# EAGLE design untitled (EAGLE 9.6.2)
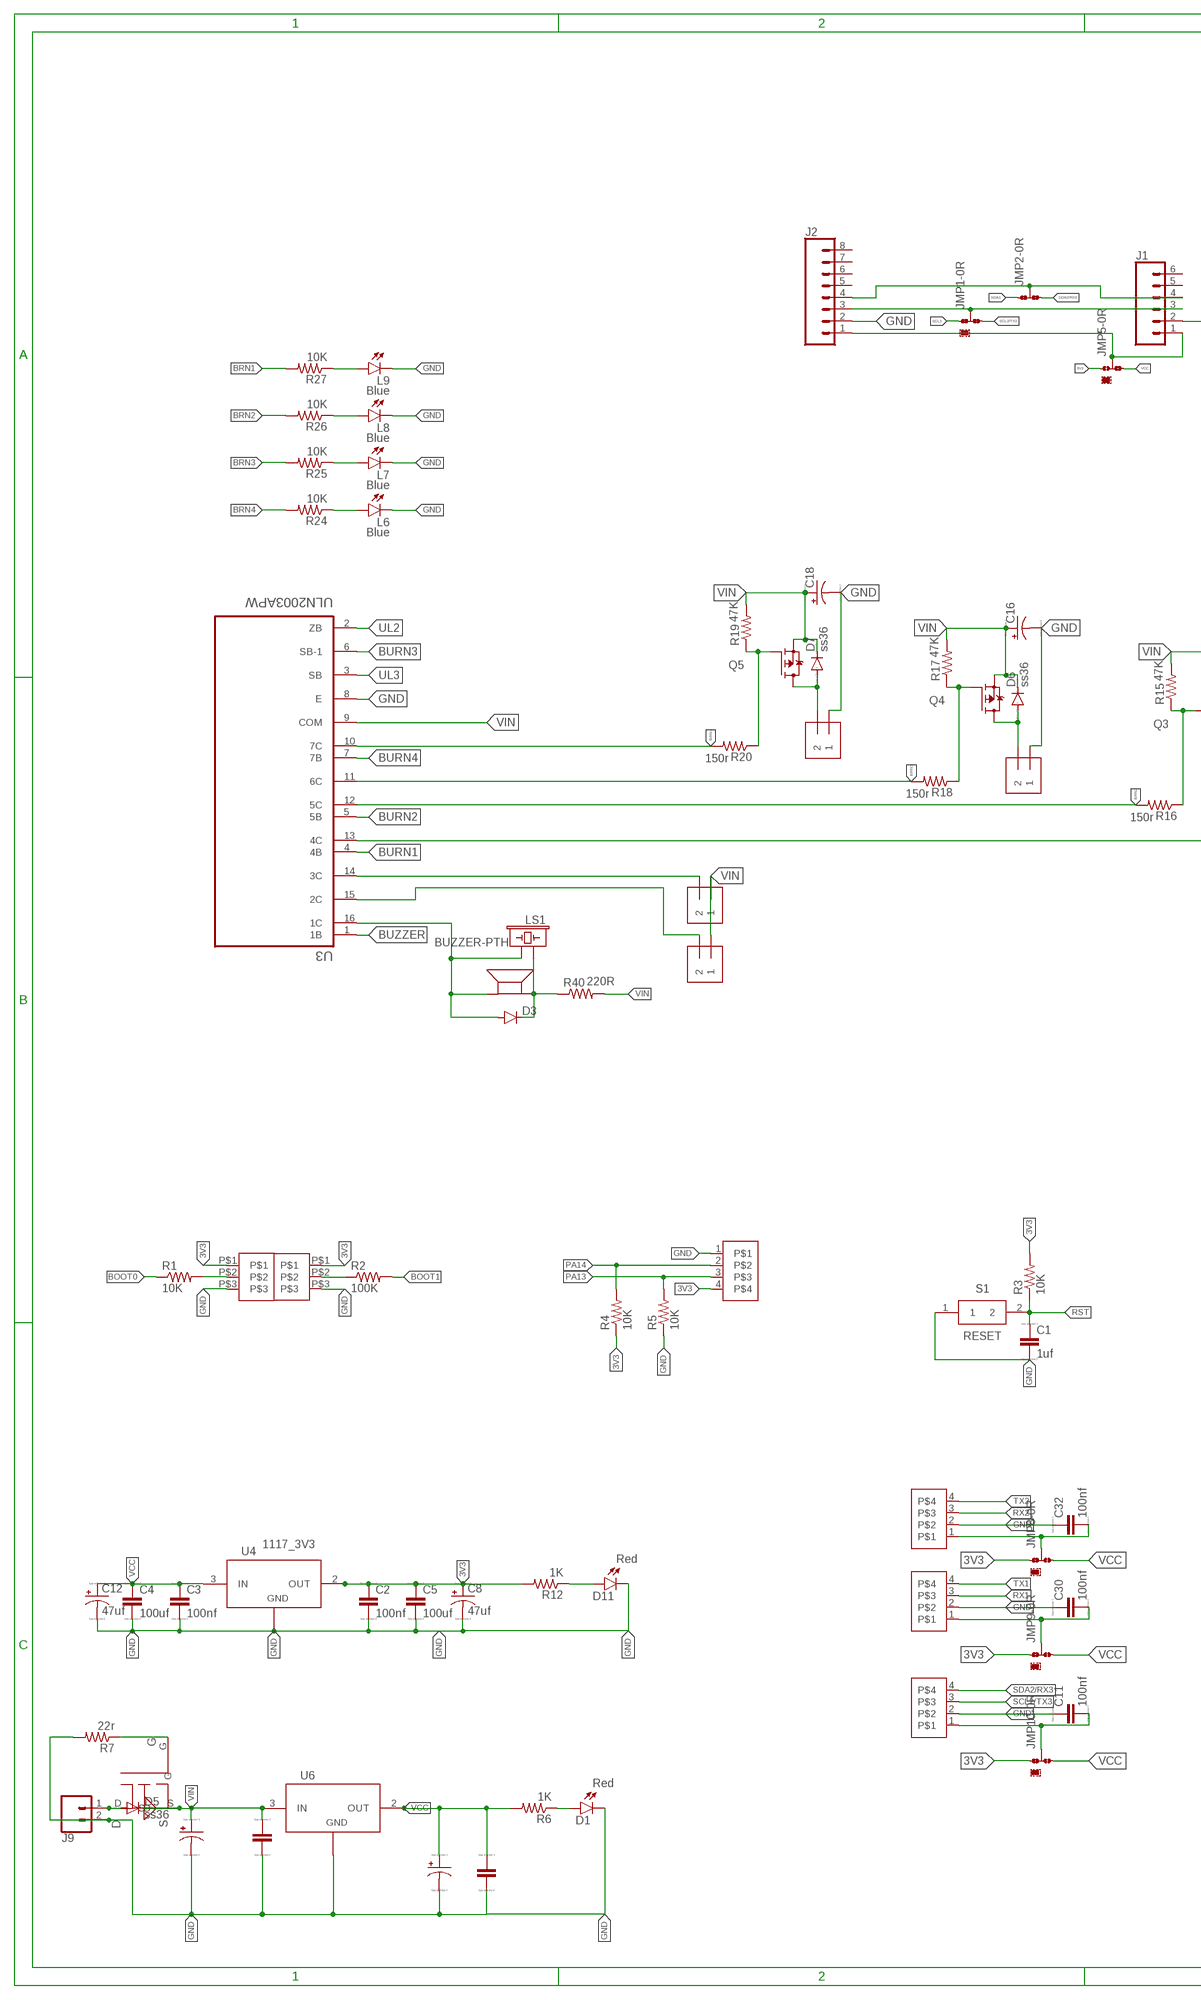
[diagram p0: schematic, sheet 1, part 1 of 2]
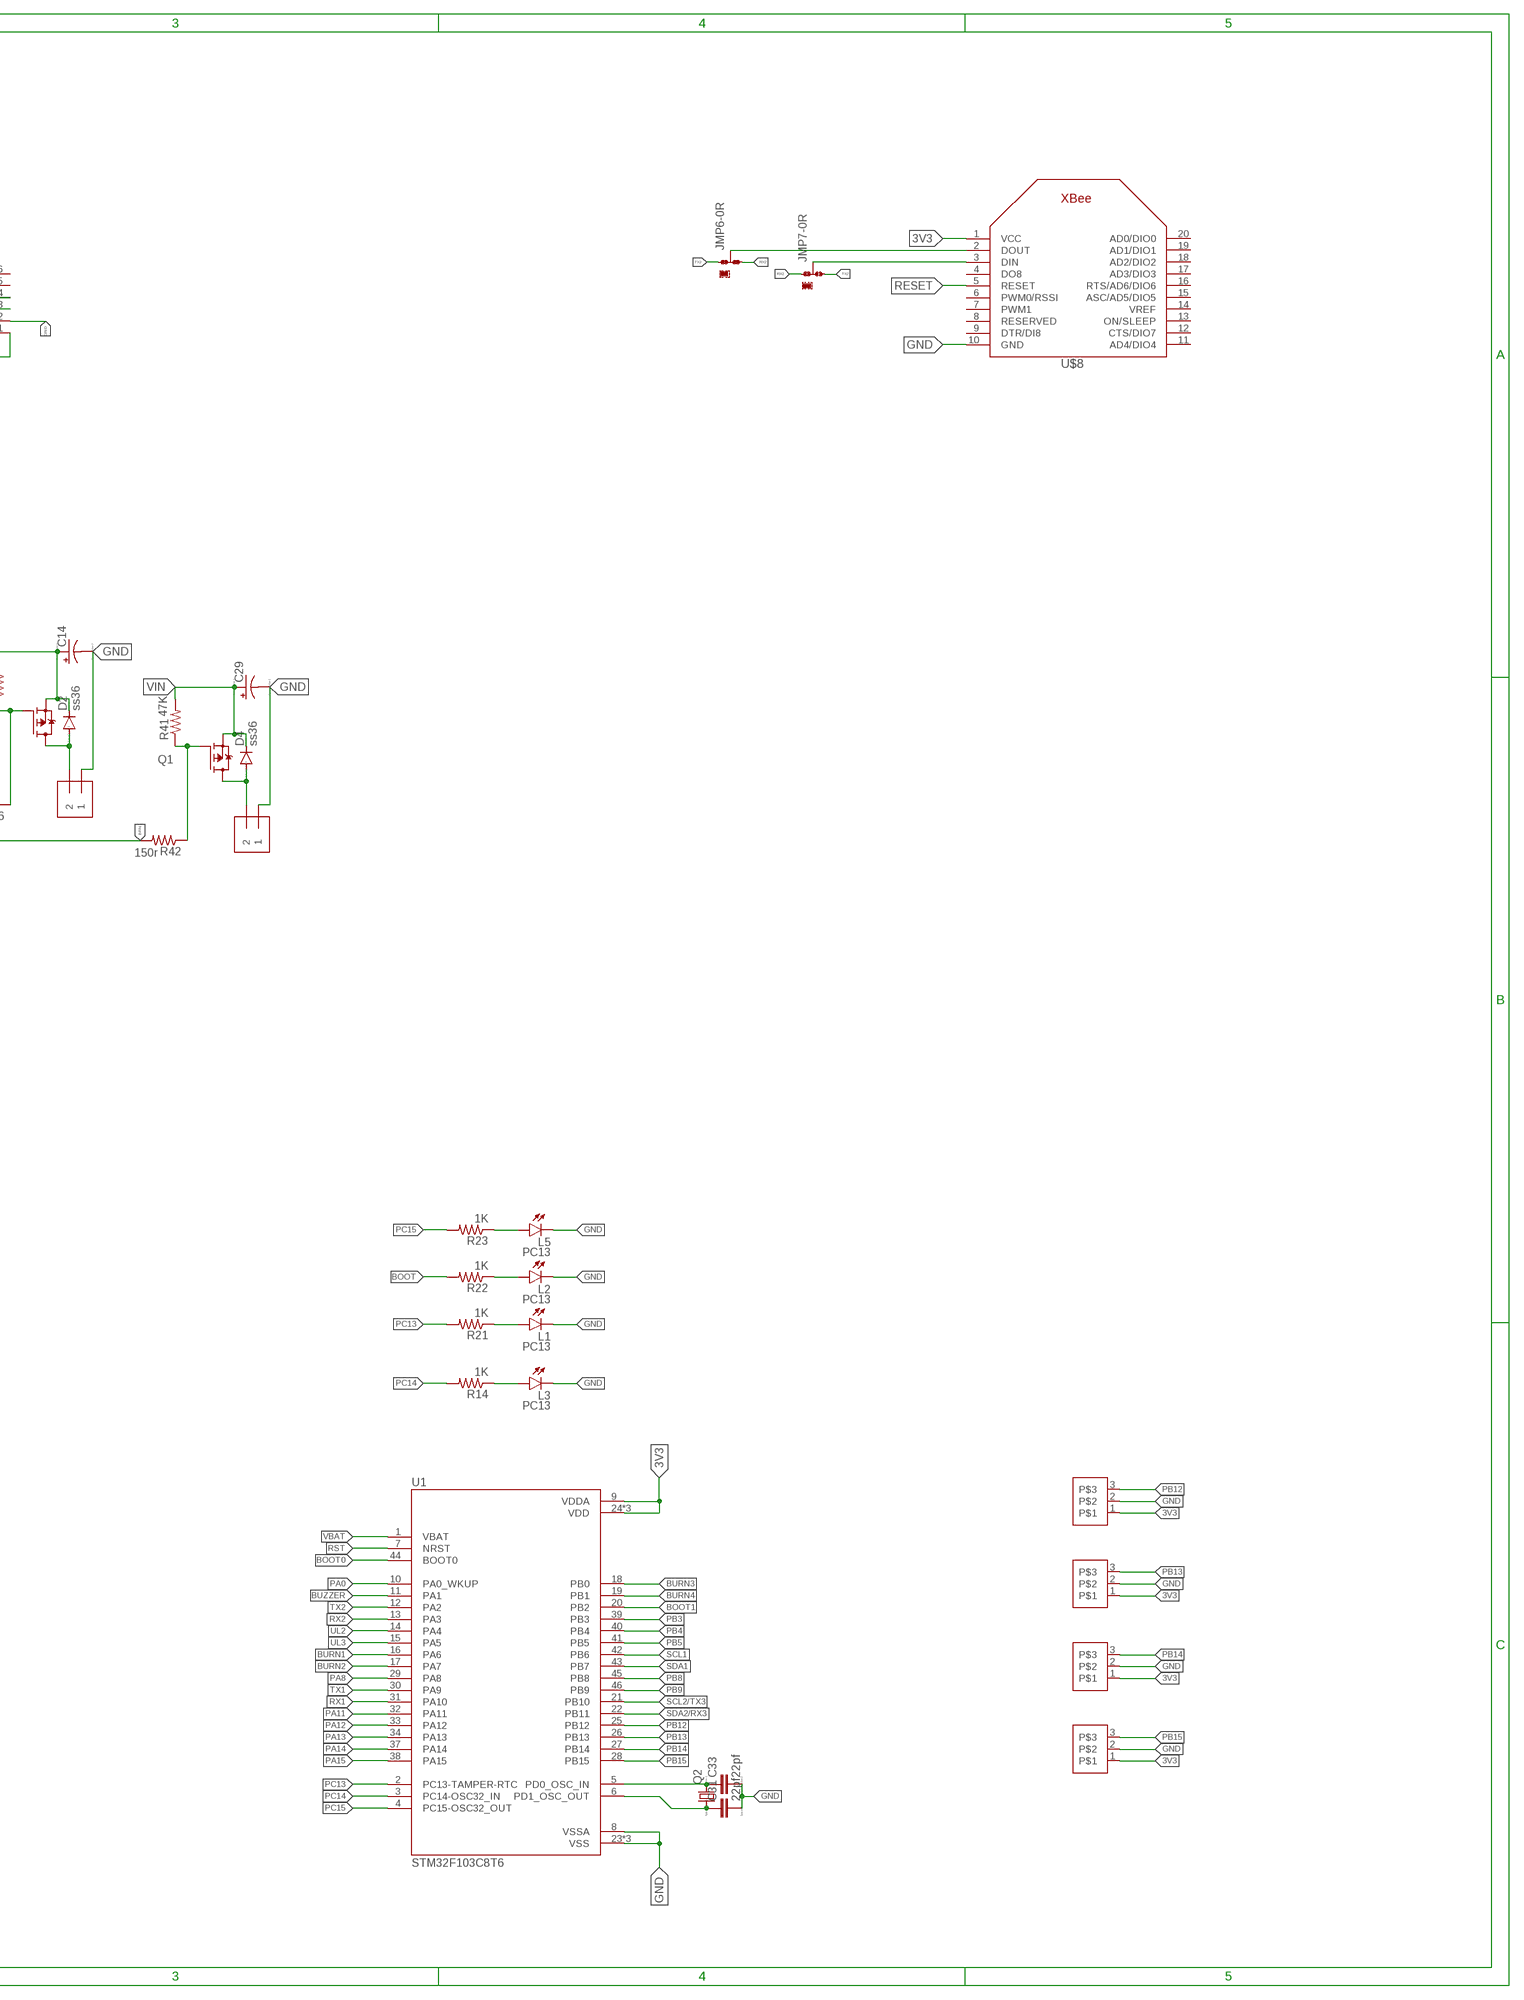
[diagram p1: schematic, sheet 1, part 2 of 2]

## Parts
C1  1uf  CAPACITOR_CER4  [C0603]
C2  100nf  CAPACITOR_CER4  [C0603]
C3  100nf  CAPACITOR_CER4  [C0603]
C4  100uf  CAPACITOR_CER9  [C1210]
C5  100uf  CAPACITOR_CER9  [C1210]
C6  100nf  CAPACITOR_CER4  [C0603]
C7  100uf  CAPACITOR_POLD  [PANASONIC_D]
C8  47uf  CAPACITOR_POLC  [PANASONIC_C]
C9  100nf  CAPACITOR_CER4  [C0603]
C10  100uf  CAPACITOR_POLD  [PANASONIC_D]
C11  100nf  CAPACITOR_CER4  [C0603]
C12  47uf  CAPACITOR_POLC  [PANASONIC_C]
C14  CAPACITOR_POLC  [PANASONIC_C]
C16  CAPACITOR_POLC  [PANASONIC_C]
C18  CAPACITOR_POLC  [PANASONIC_C]
C29  CAPACITOR_POLC  [PANASONIC_C]
C30  100nf  CAPACITOR_CER4  [C0603]
C31  22pf  CAPACITOR_CER4  [C0603]
C32  100nf  CAPACITOR_CER4  [C0603]
C33  22pf  CAPACITOR_CER4  [C0603]
D1  Red  LED0603_R  [0603_LED_GREEN]
D2  ss36  DIODEAC2  [DO-214AC]
D3  DIODESOD  [SOD-323]
D4  ss36  DIODEAC2  [DO-214AC]
D5  ss36  DIODEAC2  [DO-214AC]
D6  ss36  DIODEAC2  [DO-214AC]
D7  ss36  DIODEAC2  [DO-214AC]
D11  Red  LED0603_R  [0603_LED_GREEN]
J1  CONN_06NO_SILK_NO_POP  [1X06_NO_SILK]
J2  CONN_08NO_SILK_FEMALE_PTH  [1X08_NO_SILK]
J9  CONN_025MM  [SCREWTERMINAL-5MM-2]
JMP1  0R-JUMPA  [A0R-JMP]
JMP2  0R-JUMPA  [A0R-JMP]
JMP5  0R-JUMPA  [A0R-JMP]
JMP6  0R-JUMPA  [A0R-JMP]
JMP7  0R-JUMPA  [A0R-JMP]
JMP8  0R-JUMPA  [A0R-JMP]
JMP9  0R-JUMPA  [A0R-JMP]
JMP10  0R-JUMPA  [A0R-JMP]
L1  PC13  LED0603_R  [0603_LED_GREEN]
L2  PC13  LED0603_R  [0603_LED_GREEN]
L3  PC13  LED0603_R  [0603_LED_GREEN]
L5  PC13  LED0603_R  [0603_LED_GREEN]
L6  Blue  LED0603_R  [0603_LED_GREEN]
L7  Blue  LED0603_R  [0603_LED_GREEN]
L8  Blue  LED0603_R  [0603_LED_GREEN]
L9  Blue  LED0603_R  [0603_LED_GREEN]
LS1  BUZZER-PTH  [BUZZER-12MM]
Q1  FDD4141TO252  [TO252]
Q2  CRYSTALHC49U-V  [HC49U-V]
Q3  FDD4141TO252  [TO252]
Q4  FDD4141TO252  [TO252]
Q5  FDD4141TO252  [TO252]
Q6  AON7401  [DFN-8_3X3]
R1  10K  RESISTOR0603  [R0603]
R2  100K  RESISTOR0603  [R0603]
R3  10K  RESISTOR0603  [R0603]
R4  10K  RESISTOR0603  [R0603]
R5  10K  RESISTOR0603  [R0603]
R6  1K  RESISTOR0603  [R0603]
R7  22r  RESISTOR0603  [R0603]
R12  1K  RESISTOR0603  [R0603]
R14  1K  RESISTOR0603  [R0603]
R15  47K  RESISTOR0603  [R0603]
R16  150r  RESISTOR0603  [R0603]
R17  47K  RESISTOR0603  [R0603]
R18  150r  RESISTOR0603  [R0603]
R19  47K  RESISTOR0603  [R0603]
R20  150r  RESISTOR0603  [R0603]
R21  1K  RESISTOR0603  [R0603]
R22  1K  RESISTOR0603  [R0603]
R23  1K  RESISTOR0603  [R0603]
R24  10K  RESISTOR0603  [R0603]
R25  10K  RESISTOR0603  [R0603]
R26  10K  RESISTOR0603  [R0603]
R27  10K  RESISTOR0603  [R0603]
R40  220R  RESISTOR0603  [R0603]
R41  47K  RESISTOR0603  [R0603]
R42  150r  RESISTOR0603  [R0603]
S1  RESET  SKRKAEE010  [SKRK]
U1  STM32F103C8T6  [QFP50P900X900X160-48N]
U3  ULN2003APW  [SOP65P640X120-16N]
U4  1117_3V3  NCP1117ST33T3G  [SOT-223]
U6  1117_3V3  NCP1117ST33T3G  [SOT-223]
U$1  FML_1X32MM  [1X3_2MM]
U$2  FML_1X32MM  [1X3_2MM]
U$3  FML_1X4  [HDRVR4W64P254_1X4_1016X240X800B]
U$4  1X2  [1X2]
U$5  1X2  [1X2]
U$6  1X2  [1X2]
U$7  FML_1X4  [HDRVR4W64P254_1X4_1016X240X800B]
U$8  XBEE  [XBEE]
U$9  Z_STOP  FML_1X3  [HDRVR3W64P254_1X3_762X240X800B]
U$11  FML_1X4  [HDRVR4W64P254_1X4_1016X240X800B]
U$12  FML_1X4  [HDRVR4W64P254_1X4_1016X240X800B]
U$13  Z_STOP  FML_1X3  [HDRVR3W64P254_1X3_762X240X800B]
U$14  Y_STOP  FML_1X3  [HDRVR3W64P254_1X3_762X240X800B]
U$15  X_STOP  FML_1X3  [HDRVR3W64P254_1X3_762X240X800B]
U$19  7.5X7.5_BUZZER  [SMD_7.5_BUZZER]
U$20  1X2  [1X2]
U$21  1X2  [1X2]
U$22  1X2  [1X2]

## Nets
3V3: C2.1 C5.1 C8.+ JMP5.1 JMP8.1 JMP9.1 JMP10.1 R3.2 R4.1 R12.2 U1.9(VDDA) U1.24(VDD) U1.36(VDD) U1.48(VDD) U4.2(OUT) U4.4 U$1.P$1 U$2.P$1 U$3.4 U$8.1(VCC) U$9.1 U$13.1 U$14.1 U$15.1
BOOT: R1.2 R22.2 U$2.P$2
BOOT0: R1.1 U1.44(BOOT0)
BOOT1: R2.2 U1.20(PB2)
BRN1: R27.2 R42.2 U3.13(4C)
BRN2: R16.2 R26.2 U3.12(5C)
BRN3: R18.2 R25.2 U3.11(6C)
BRN4: R20.2 R24.2 U3.10(7C)
BURN1: U1.16(PA6) U3.4(4B)
BURN2: U1.17(PA7) U3.5(5B)
BURN3: U1.18(PB0) U3.6(SB-1)
BURN4: U1.19(PB1) U3.7(7B)
BUZZER: U1.11(PA1) U3.1(1B)
GND: C1.2 C2.2 C3.2 C4.2 C5.2 C6.2 C7.- C8.- C9.2 C10.- C11.1 C12.- C14.- C16.- C18.- C29.- C30.1 C31.2 C32.1 C33.2 D1.C D11.C J1.2 J2.2 J9.2 L1.C L2.C L3.C L5.C L6.C L7.C L8.C L9.C R5.1 R7.2 S1.1 U1.8(VSSA) U1.23(VSS) U1.35(VSS) U1.47(VSS) U3.8(E) U4.1(ADJ/GND) U6.1(ADJ/GND) U$1.P$3 U$2.P$3 U$3.1 U$4.P$1 U$5.P$1 U$6.P$1 U$7.2 U$8.10(GND) U$9.2 U$11.2 U$12.2 U$13.2 U$14.2 U$15.2 U$21.P$1
N$2: Q6.G R7.1
N$5: R2.1 U$1.P$2
N$7: D1.A R6.1
N$8: D11.A R12.1
N$9: JMP6.2 U$8.2(DOUT)
N$10: JMP7.2 U$8.3(DIN)
N$11: C30.2 JMP9.2 U$12.1
N$12: L3.A R14.1
N$13: D2.A Q3.3(D) U$4.P$2
N$14: Q3.1(G) R15.1 R16.1
N$15: D6.A Q4.3(D) U$5.P$2
N$16: Q4.1(G) R17.1 R18.1
N$17: D7.A Q5.3(D) U$6.P$2
N$18: Q5.1(G) R19.1 R20.1
N$19: C33.1 Q2.2 U1.5(PD0_OSC_IN)
N$20: C31.1 Q2.1 U1.6(PD1_OSC_OUT)
N$21: L1.A R21.1
N$22: L2.A R22.1
N$23: L5.A R23.1
N$24: L6.A R24.1
N$25: L7.A R25.1
N$26: L8.A R26.1
N$27: L9.A R27.1
N$28: C11.2 JMP10.2 U$7.1
N$29: J1.1 J2.1 JMP5.2
N$30: J1.3 J2.3 JMP1.2
N$31: J1.4 J2.4 JMP2.2
N$49: C32.2 JMP8.2 U$11.1
N$59: D5.A J9.1 Q6.D
N$71: U3.15(2C) U$20.P$2
N$72: U3.14(3C) U$22.P$2
N$76: D3.A LS1.- U3.16(1C) U$19.-
N$77: D3.C LS1.+ R40.1 U$19.+
N$78: D4.A Q1.3(D) U$21.P$2
N$79: Q1.1(G) R41.1 R42.1
PA0: U1.10(PA0_WKUP)
PA8: U1.29(PA8)
PA11: U1.32(PA11)
PA12: U1.33(PA12)
PA13: R5.2 U1.34(PA13) U$3.3
PA14: R4.2 U1.37(PA14) U$3.2
PA15: U1.38(PA15)
PB3: U1.39(PB3)
PB4: U1.40(PB4)
PB5: U1.41(PB5)
PB8: U1.45(PB8)
PB9: U1.46(PB9)
PB12: U1.25(PB12) U$9.3
PB13: U1.26(PB13) U$13.3
PB14: U1.27(PB14) U$14.3
PB15: U1.28(PB15) U$15.3
PC13: R21.2 U1.2(PC13-TAMPER-RTC)
PC14: R14.2 U1.3(PC14-OSC32_IN)
PC15: R23.2 U1.4(PC15-OSC32_OUT)
RESET: U$8.5(RESET)
RST: C1.1 R3.1 S1.2 U1.7(NRST)
RX1: U1.31(PA10) U$12.3
RX2: JMP6.3 JMP7.1 U1.13(PA3) U$11.3
SCL1: JMP1.1 U1.42(PB6)
SCL2/TX3: JMP1.3 U1.21(PB10) U$7.3
SDA1: JMP2.1 U1.43(PB7)
SDA2/RX3: JMP2.3 U1.22(PB11) U$7.4
TX1: U1.30(PA9) U$12.4
TX2: JMP6.1 JMP7.3 U1.12(PA2) U$11.4
UL2: U1.14(PA4) U3.2(ZB)
UL3: U1.15(PA5) U3.3(SB)
VBAT: U1.1(VBAT)
VCC: C3.1 C4.1 C6.1 C7.+ C12.+ JMP5.3 JMP8.3 JMP9.3 JMP10.3 R6.2 U4.3(IN) U6.2(OUT) U6.4
VIN: C9.1 C10.+ C14.+ C16.+ C18.+ C29.+ D2.C D4.C D5.C D6.C D7.C Q1.2(S) Q3.2(S) Q4.2(S) Q5.2(S) Q6.S R15.2 R17.2 R19.2 R40.2 R41.2 U3.9(COM) U6.3(IN) U$20.P$1 U$22.P$1
Unconnected: J1.5 J1.6 J2.5 J2.6 J2.7 J2.8 U$8.4(DO8) U$8.6(PWM0/RSSI) U$8.7(PWM1) U$8.8(RESERVED) U$8.9(DTR/DI8) U$8.11(AD4/DIO4) U$8.12(CTS/DIO7) U$8.13(ON/SLEEP) U$8.14(VREF) U$8.15(ASC/AD5/DIO5) U$8.16(RTS/AD6/DIO6) U$8.17(AD3/DIO3) U$8.18(AD2/DIO2) U$8.19(AD1/DIO1) U$8.20(AD0/DIO0)

## Library data of the parts
C1-C6 C9 C11 C30-C33 = pasif_com1:CAPACITOR_CER
C7 C8 C10 C12 C14 C16 C18 C29 = pasif_com1:CAPACITOR_POL
D1 D11 L1-L3 L5-L9 = pasif_com1:LED
D2 D4-D7 = pasif_com1:DIODE
D3 = BeagleBone_Blue_R3:DIODE: Diode These are standard reverse protection diodes and small signal diodes. SMA package can handle up to about 1A. SOD-323 can handle about 200mA. What the SOD-323 package when ordering, there are some mfgs out there that are 5-pin packages.; PROD_ID: DIO-09646
J1 = SparkFun-Connectors:CONN_06: Multi connection point. Often used as Generic Header-pin footprint for 0.1 inch spaced/style header connections On any of the 0.1 inch spaced packages, you can populate with these: Break Away Headers - Straight <https://www.sparkfun.com/products/116> (PRT-00116) Break Away Male Headers - Right Angle <https://www.sparkfun.com/products/553> (PRT-00553) Female Headers <https://www.sparkfun.com/products/115> (PRT-00115) Break Away Headers - Machine Pin <https://www.sparkfun.com/products/117> (PRT-00117) Break Away Female Headers - Swiss Machine Pin <https://www.sparkfun.com/products/743> (PRT-00743) Arduino Stackable Header - 6 Pin <https://www.sparkfun.com/products/9280> (PRT-09280) For SCREWTERMINALS and SPRING TERMINALS visit here: Screw Terimnals on SparkFun.com <https://www.sparkfun.com/search/results?term=Screw+Terminals> (5mm/3.5mm/2.54mm spacing) This device is also useful as a general connection point to wire up your design to another part of your project. Our various solder wires solder well into these plated through hole pads. Hook-Up Wire - Assortment (Stranded, 22 AWG) <https://www.sparkfun.com/products/11375> (PRT-11375) Hook-Up Wire - Assortment (Solid Core, 22 AWG) <https://www.sparkfun.com/products/11367> (PRT-11367) View the entire wire category on our website here <https://www.sparkfun.com/categories/141>
J2 = SparkFun-Connectors:CONN_08: Multi connection point. Often used as Generic Header-pin footprint for 0.1 inch spaced/style header connections On any of the 0.1 inch spaced packages, you can populate with these: Break Away Headers - Straight <https://www.sparkfun.com/products/116> (PRT-00116) Break Away Male Headers - Right Angle <https://www.sparkfun.com/products/553> (PRT-00553) Female Headers <https://www.sparkfun.com/products/115> (PRT-00115) Break Away Headers - Machine Pin <https://www.sparkfun.com/products/117> (PRT-00117) Break Away Female Headers - Swiss Machine Pin <https://www.sparkfun.com/products/743> (PRT-00743) Arduino Stackable Header - 8 Pin <https://www.sparkfun.com/products/9279> (PRT-09279) For SCREWTERMINALS and SPRING TERMINALS visit here: Screw Terimnals on SparkFun.com <https://www.sparkfun.com/search/results?term=Screw+Terminals> (5mm/3.5mm/2.54mm spacing) This device is also useful as a general connection point to wire up your design to another part of your project. Our various solder wires solder well into these plated through hole pads. Hook-Up Wire - Assortment (Stranded, 22 AWG) <https://www.sparkfun.com/products/11375> (PRT-11375) Hook-Up Wire - Assortment (Solid Core, 22 AWG) <https://www.sparkfun.com/products/11367> (PRT-11367) View the entire wire category on our website here <https://www.sparkfun.com/categories/141> Special notes: Molex polarized connector foot print use with SKU : PRT-08231 with associated crimp pins and housings. 1MM SMD Version SKU: PRT-10208 NOTES ON THE VARIANTS LOCK and LOCK_LONGPADS... This footprint was designed to help hold the alignment of a through-hole component (i.e. 6-pin header) while soldering it into place. You may notice that each hole has been shifted either up or down by 0.005 of an inch from it's more standard position (which is a perfectly straight line). This slight alteration caused the pins (the squares in the middle) to touch the edges of the holes. Because they are alternating, it causes a "brace" to hold the component in place. 0.005 has proven to be the perfect amount of "off-center" position when using our standard breakaway headers. Although looks a little odd when you look at the bare footprint, once you have a header in there, the alteration is very hard to notice. Also,if you push a header all the way into place, it is covered up entirely on the bottom side.; PROD_ID: CONN-08438
J9 = SparkFun-Connectors:CONN_02: Multi connection point. Often used as Generic Header-pin footprint for 0.1 inch spaced/style header connections On any of the 0.1 inch spaced packages, you can populate with these: Break Away Headers - Straight <https://www.sparkfun.com/products/116> (PRT-00116) Break Away Male Headers - Right Angle <https://www.sparkfun.com/products/553> (PRT-00553) Female Headers <https://www.sparkfun.com/products/115> (PRT-00115) Break Away Headers - Machine Pin <https://www.sparkfun.com/products/117> (PRT-00117) Break Away Female Headers - Swiss Machine Pin <https://www.sparkfun.com/products/743> (PRT-00743) For SCREWTERMINALS and SPRING TERMINALS visit here: Screw Terimnals on SparkFun.com <https://www.sparkfun.com/search/results?term=Screw+Terminals> (5mm/3.5mm/2.54mm spacing) This device is also useful as a general connection point to wire up your design to another part of your project. Our various solder wires solder well into these plated through hole pads. Hook-Up Wire - Assortment (Stranded, 22 AWG) <https://www.sparkfun.com/products/11375> (PRT-11375) Hook-Up Wire - Assortment (Solid Core, 22 AWG) <https://www.sparkfun.com/products/11367> (PRT-11367) View the entire wire category on our website here <https://www.sparkfun.com/categories/141> Special notes: Molex polarized connector foot print use with: PRT-08233 with associated crimp pins and housings. 2.54_SCREWTERM for use with PRT-10571. 3.5mm Screw Terminal footprints for PRT-08084 5mm Screw Terminal footprints for use with PRT-08432; SF_SKU: PRT-08432
JMP1 JMP2 JMP5-JMP10 = jump-0r-smd:0R-JUMP: SMD 0R 0805 Jumper
LS1 = SparkFun-Electromechanical:BUZZER: Buzzer Small round buzzers that operate around the audible 2kHz range. You can use these as speakers to create simple music or user interfaces. Variant Overview: PTH - Mini Speaker - PC Mount 12mm 2.048kHz <https://www.sparkfun.com/products/7950> PTH_KIT - Mini Speaker - PC Mount 12mm 2.048kHz <https://www.sparkfun.com/products/7950> KIT simplifies soldering by adding stop mask to one side of the pads. PTH_NO_SILK - Mini Speaker - PC Mount 12mm 2.048kHz <https://www.sparkfun.com/products/7950> No silkscreen indicator of buzzer outline. PTH_KIT_NO_SILK - Mini Speaker - PC Mount 12mm 2.048kHz <https://www.sparkfun.com/products/7950> KIT package w/o silkscreen SMD - Buzzer Audio Magnetic (CCV-084B16) SMD buzzer used on, e.g. the LilyPad Buzzer <https://www.sparkfun.com/products/8463> and RFID USB Reader <https://www.sparkfun.com/products/9963>. SMD_KIT - Buzzer Audio Magnetic (CCV-084B16) SMD Buzzer with elongated pins to make soldering easier. Used on the SparkFun Simon Says - Surface Mount Soldering Kit <https://www.sparkfun.com/products/10935>.; PROD_ID: COMP-08253; SF_SKU: COM-07950
Q1 Q3-Q5 = transistor-fet:FDD4141: P-Channel PowerTrench® MOSFET Source: FDD4141.pdf
Q2 = crystal:CRYSTAL: CRYSTAL; OC_FARNELL: 1666969; OC_NEWARK: unknown
Q6 = AON7401:AON7401
R1-R7 R12 R14-R27 R40-R42 = pasif_com1:RESISTOR
S1 = SKRKAEE010:SKRKAEE010: Tactile Switches 3.9x2.9x2.0mm 160gf Packaging Temp 60oC <https://componentsearchengine.com/Images/1/SKRKAEE010.jpg> Source: Datasheet <http://www.mouser.com/ds/2/15/SKRK-1110686.pdf>; AVAILABILITY: Unavailable; DESCRIPTION: Switch Tactile N.O. SPST Round Button Gull Wing 0.05A 12VDC 1.57N SMD T/R; MF: ALPS; MP: SKRKAEE010; PACKAGE: None; PRICE: None
U1 = STM32F103C8T6:STM32F103C8T6: Mainstream Performance line, ARM Cortex-M3 MCU with 64 Kbytes Flash, 72 MHz CPU, motor control, USB and CAN; AVAILABILITY: Unavailable; DESCRIPTION: Mainstream Performance line, ARM Cortex-M3 MCU with 64 Kbytes Flash, 72 MHz CPU, motor control, USB and CAN; MF: STMicroelectronics; MP: STM32F103C8T6; PACKAGE: LQFP-48 STMicroelectronics; PRICE: None
U3 = ULN2003APW:ULN2003APW: Check prices <https://pricing.snapeda.com/parts/ULN2003APW/Texas%20Instruments/view-part?ref=eda>; AVAILABILITY: Good; DESCRIPTION: 50-V, 7-ch darlington transistor array, -20C to 70C 16-TSSOP -40 to 70; MF: Texas Instruments; MP: ULN2003APW; PACKAGE: TSSOP-16 Texas Instruments; PRICE: None; PURCHASE-URL: https://pricing.snapeda.com/search/part/ULN2003APW/?ref=eda
U4 U6 = IC:NCP1117ST33T3G: IC REG LINEAR 3.3V 1A SOT223 Manufacturer's datasheet <https://www.onsemi.com/pub/Collateral/NCP1117-D.PDF>; CREATED_BY: PCBLayout.com; DIGIKEY_PART_NUMBER: NCP1117ST33T3GOSTR-ND; MANUFACTURER: ON Semiconductor; MPN: NCP1117ST33T3G; PACKAGE: SOT-223
U$1 U$2 U$9 U$13-U$15 = header_3d:FML_1X3
U$3 U$7 U$11 U$12 = header_3d:FML_1X4
U$4-U$6 U$20-U$22 = header_3d:1X2
U$8 = adafruit:XBEE
U$19 = buzzer_smd_no_drill:7.5X7.5_BUZZER

## Board
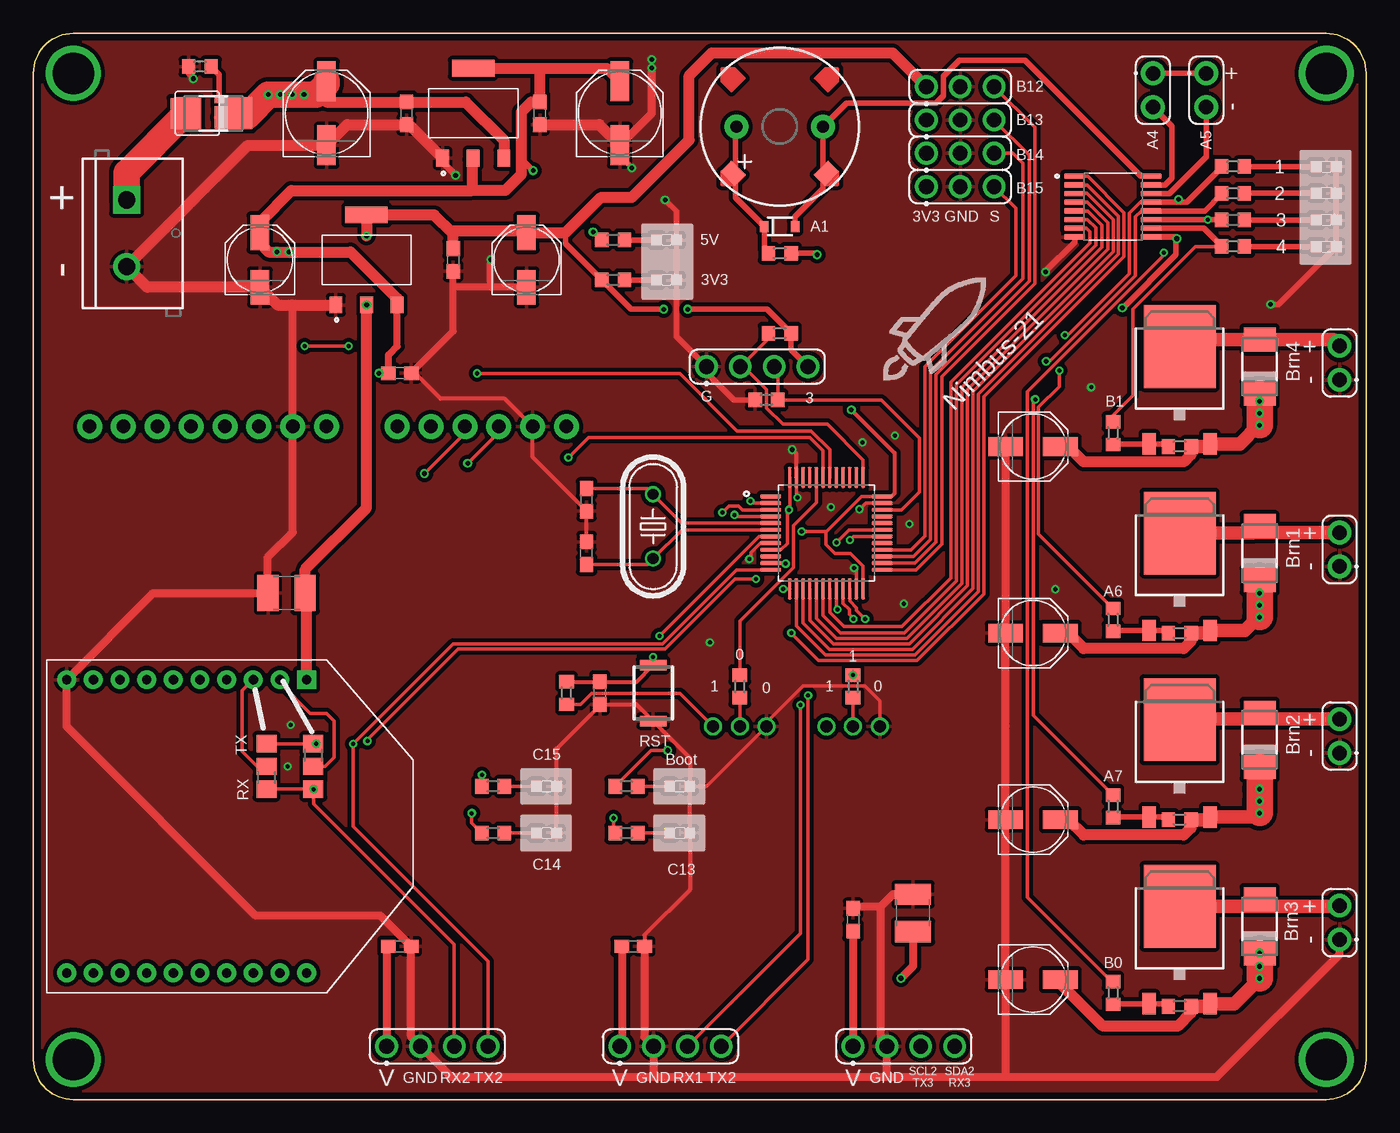
[diagram p2: board, top side]
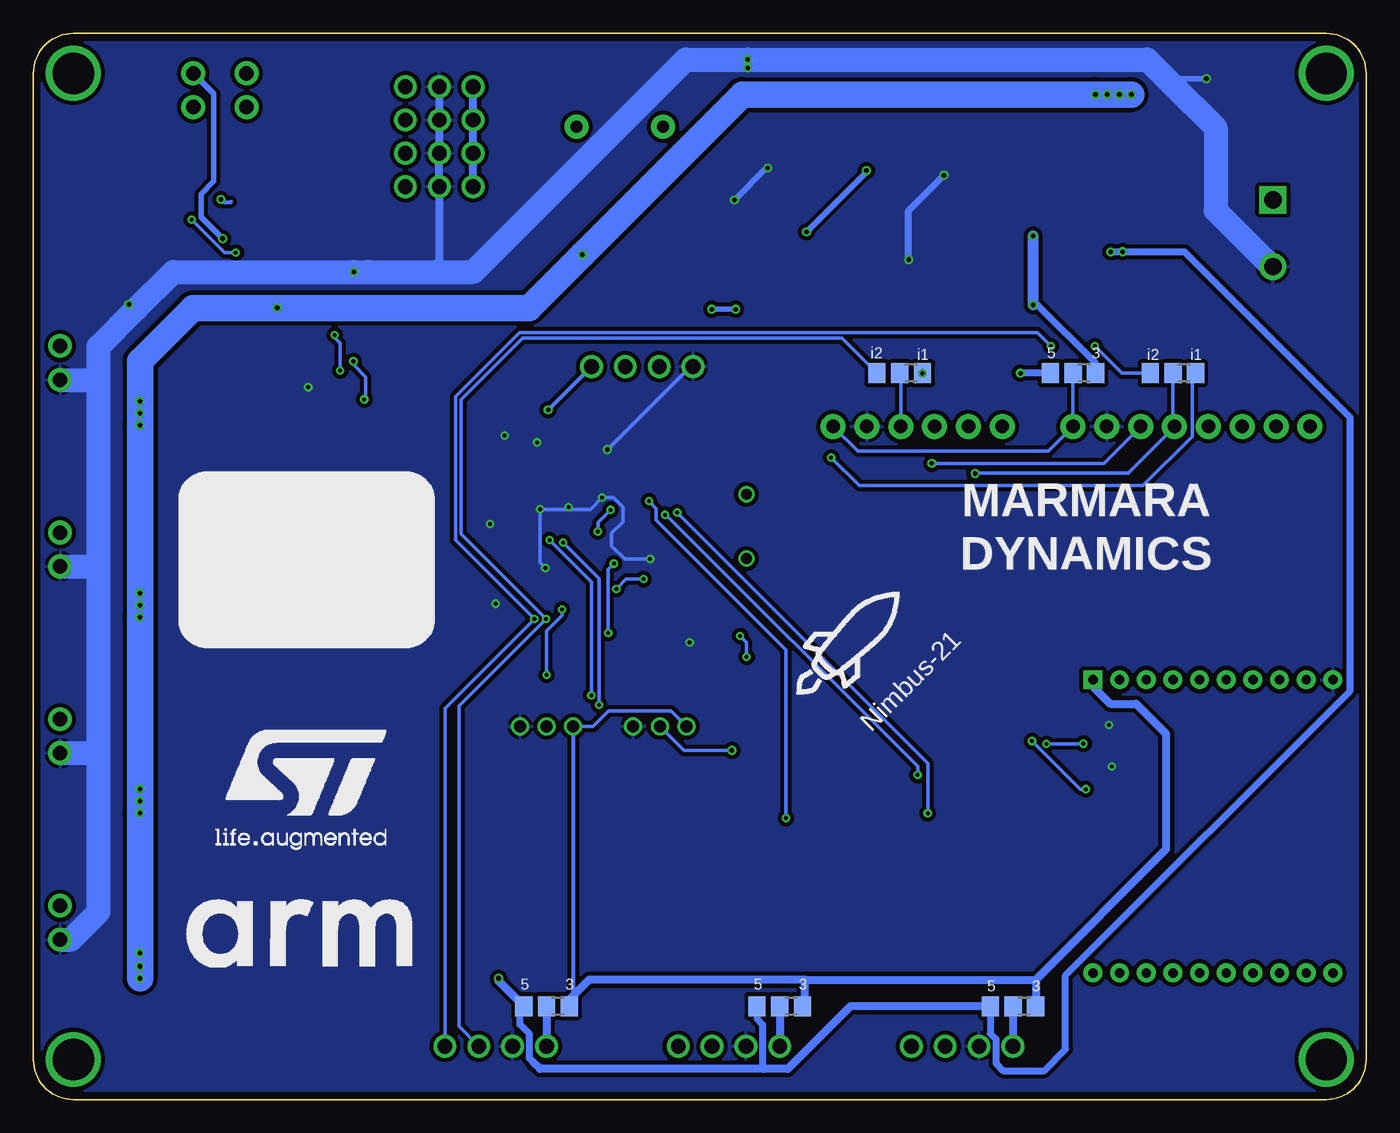
[diagram p3: board, bottom side, seen from below]

Size 100 x 80 mm. Coordinates in mm from the lower left corner, seen from the top.
Outline: 0,3 arc90 3,0 97,0 arc90 100,3 100,77 arc90 97,80 3,80 arc90 0,77 0,3
Copper layers (1*16): Top 0.035mm / dielectric 1.6mm / Bottom 0.035mm
Design rules "Elecrow_2-layer_PCB_eagle_rule": minimum track width 6mil, minimum drill 12mil, track to track 6mil, track to pad 6mil, pad to pad 6mil, via to via 8mil, smd to smd 0mil, copper to edge 20mil, drill to drill 10mil, minimum pad ring 6mil, minimum via ring 6mil, stop-mask expansion 0mil, vias tented up to drill 100mil, thermal gap 10mil

### Footprints (pad centres in the part's own frame; a part is rotated, then mirrored left to right if it is on the bottom)
C0603 = smd 1.1 x 1: 1 -0.85,0; 2 0.85,0
C1210 = smd 1.6 x 2.7: 1 -1.4,0; 2 1.4,0
PANASONIC_D = smd 3 x 1.4: + 2.4,0; - -2.4,0
PANASONIC_C = smd 2.6 x 1.4: + 2.05,0; - -2.05,0
0603_LED_GREEN = smd 0.8 x 0.8: A 0,-0.75; C 0,0.75
DO-214AC = smd 1.8 x 2.4: A 2.025,0; C -2.025,0
SOD-323 = smd 0.63 x 0.83: A 1.15,0; C -1.15,0
1X06_NO_SILK = drill 1.016 pad 1.88: 1 0,0; 2 2.54,0; 3 5.08,0; 4 7.62,0; 5 10.16,0; 6 12.7,0
1X08_NO_SILK = drill 1.016 pad 1.88: 1 0,0; 2 2.54,0; 3 5.08,0; 4 7.62,0; 5 10.16,0; 6 12.7,0; 7 15.24,0; 8 17.78,0
SCREWTERMINAL-5MM-2 = drill 1.3 pad 2.032 square: 1 0,0 | drill 1.3 pad 2.032: 2 5,0
A0R-JMP = smd 1.5 x 1.3: 1 0,1.7; 2 0,0; 3 0,-1.7
BUZZER-12MM = drill 0.9 pad 1.778: + 3.25,0; - -3.25,0
TO252 = smd 1 x 1.6: 1 -2.28,-4.8; 2 2.28,-4.8 | smd 5.4 x 6.2: 3 0,2.5
HC49U-V = drill 0.813: 1 -2.413,0; 2 2.413,0
DFN-8_3X3 = smd 2.29 x 2.29: D 0,0.8 | smd 0.4 x 0.7: G 0.96,-1.7 | smd 1.7 x 0.7: S -0.3,-1.7
R0603 = smd 1 x 1.1: 1 -0.85,0; 2 0.85,0
SKRK = smd 0.8 x 2: 1 -2.1,0; 2 2.1,0
QFP50P900X900X160-48N = smd 1.56 x 0.28: 1 -4.18,2.75; 2 -4.18,2.25; 3 -4.18,1.75; 4 -4.18,1.25; 5 -4.18,0.75; 6 -4.18,0.25; 7 -4.18,-0.25; 8 -4.18,-0.75; 9 -4.18,-1.25; 10 -4.18,-1.75; 11 -4.18,-2.25; 12 -4.18,-2.75; 25 4.18,-2.75; 26 4.18,-2.25; 27 4.18,-1.75; 28 4.18,-1.25; 29 4.18,-0.75; 30 4.18,-0.25; 31 4.18,0.25; 32 4.18,0.75; 33 4.18,1.25; 34 4.18,1.75; 35 4.18,2.25; 36 4.18,2.75 | smd 0.28 x 1.56: 13 -2.75,-4.18; 14 -2.25,-4.18; 15 -1.75,-4.18; 16 -1.25,-4.18; 17 -0.75,-4.18; 18 -0.25,-4.18; 19 0.25,-4.18; 20 0.75,-4.18; 21 1.25,-4.18; 22 1.75,-4.18; 23 2.25,-4.18; 24 2.75,-4.18; 37 2.75,4.18; 38 2.25,4.18; 39 1.75,4.18; 40 1.25,4.18; 41 0.75,4.18; 42 0.25,4.18; 43 -0.25,4.18; 44 -0.75,4.18; 45 -1.25,4.18; 46 -1.75,4.18; 47 -2.25,4.18; 48 -2.75,4.18
SOP65P640X120-16N = smd 1.57 x 0.41: 1 -2.87,2.275; 2 -2.87,1.625; 3 -2.87,0.975; 4 -2.87,0.325; 5 -2.87,-0.325; 6 -2.87,-0.975; 7 -2.87,-1.625; 8 -2.87,-2.275; 9 2.87,-2.275; 10 2.87,-1.625; 11 2.87,-0.975; 12 2.87,-0.325; 13 2.87,0.325; 14 2.87,0.975; 15 2.87,1.625; 16 2.87,2.275
SOT-223 = smd 0.96 x 1.26: 1 -2.3,-3.375; 2 0,-3.375; 3 2.3,-3.375 | smd 3.19 x 1.26: 4 0,3.375
1X3_2MM = drill 0.9 pad 1.32: P$1 0,0; P$2 2,0; P$3 4,0
HDRVR4W64P254_1X4_1016X240X800B = drill 1.105 pad 1.705: 1 0,0; 2 2.54,0; 3 5.08,0; 4 7.62,0
1X2 = drill 1.092 pad 1.778: P$1 0,0; P$2 2.54,0
XBEE = drill 0.7 pad 1.422 square: 1 -11,5.5 | drill 0.7 pad 1.422: 2 -11,3.5; 3 -11,1.5; 4 -11,-0.5; 5 -11,-2.5; 6 -11,-4.5; 7 -11,-6.5; 8 -11,-8.5; 9 -11,-10.5; 10 -11,-12.5; 11 11,-12.5; 12 11,-10.5; 13 11,-8.5; 14 11,-6.5; 15 11,-4.5; 16 11,-2.5; 17 11,-0.5; 18 11,1.5; 19 11,3.5; 20 11,5.5
HDRVR3W64P254_1X3_762X240X800B = drill 1.105 pad 1.705: 1 0,0; 2 2.54,0; 3 5.08,0
SMD_7.5_BUZZER = smd 1.55 x 1.2 rotated 45: + -3.5,3.5 | smd 1.55 x 1.2 rotated 135: - -3.5,-3.5

### Placement (x,y rotation side)
C1  42.5,30.5 270 top
C2  31.5,63 270 top
C3  38,74 270 top
C4  66,14 90 top
C5  19,38 180 top
C6  27.5,54.5 0 top
C7  44,74 90 top
C8  37,63 90 top
C9  28,74 270 top
C10  22,74 90 top
C11  61.5,13.5 270 top
C12  17,63 90 top
C14  75,21 0 top
C16  75,9 0 top
C18  75,49 0 top
C29  75,35 0 top
C30  45,11.5 180 top
C31  41.5,41 90 top
C32  27.5,11.5 180 top
C33  41.5,45 270 top
D1  47.5,64.5 270 top
D2  92,27 90 top
D3  56,65.5 0 top
D4  92,41 90 top
D5  13.5,74 180 top
D6  92,13 90 top
D7  92,55 90 top
D11  47.5,61.5 270 top
J1  40,50.5 180 top
J2  22,50.5 180 top
J9  7,67.5 270 top
JMP1  35,54.5 270 bottom
JMP2  14.5,54.5 270 bottom
JMP5  22,54.5 270 bottom
JMP6  21,25 0 top
JMP7  17.5,25 180 top
JMP8  26.5,7 270 bottom
JMP9  44,7 270 bottom
JMP10  61.5,7 270 bottom
L1  48.5,20 270 top
L2  48.5,23.5 270 top
L3  38.5,20 270 top
L5  38.5,23.5 270 top
L6  97,64 270 top
L7  97,66 270 top
L8  97,68 270 top
L9  97,70 270 top
LS1  56,73 180 top
Q1  86,40 0 top
Q2  46.5,43 90 top
Q3  86,26 0 top
Q4  86,12 0 top
Q5  86,54 0 top
Q6  12.25,74 90 top
R1  53,31 270 top
R2  61.5,31 90 top
R3  40,30.5 270 top
R4  56,57.5 180 top
R5  55,52.5 0 top
R6  43.5,64.5 180 top
R7  12.5,77.5 180 top
R12  43.5,61.5 180 top
R14  34.5,20 180 top
R15  86,21 0 top
R16  81,22 90 top
R17  86,7 0 top
R18  81,8 90 top
R19  86,49 0 top
R20  81,50 90 top
R21  44.5,20 180 top
R22  44.5,23.5 180 top
R23  34.5,23.5 180 top
R24  90,64 180 top
R25  90,66 180 top
R26  90,68 180 top
R27  90,70 180 top
R40  56,63.5 0 top
R41  86,35 0 top
R42  81,36 90 top
S1  46.5,30.5 90 top
U1  59.5,42.5 0 top
U3  81,67 0 top
U4  25,63 0 top
U6  33,74 0 top
U$1  59.5,28 0 top
U$2  51,28 0 top
U$3  50.5,55 0 top
U$4  98,26 90 top
U$5  98,12 90 top
U$6  98,54 90 top
U$7  61.5,4 0 top
U$8  15,20.5 270 top
U$9  67,76 0 top
U$11  26.5,4 0 top
U$12  44,4 0 top
U$13  67,73.5 0 top
U$14  67,71 0 top
U$15  67,68.5 0 top
U$19  56,73 90 top
U$20  84,77 270 top
U$21  98,40 90 top
U$22  88,77 270 top

### Tracks (layer width: path | path; a pad name or v marks a point on that pad's centre or on a via)
3V3  (via drill 0.3, 0.35)
  Top 0.254: R3.2 41.06,29.65 41.88,30.48 48.52,30.48 U$2.P$1 | U1.24 62.25,40.03 61.32,40.96 60.14,40.96 59.46,41.64 59.46,42.58 59.5,42.62 | 59.5,42.62 62.13,45.25 U1.36 | U1.9 56.1,41.26 56.57,41.73 56.57,44.12 v56.7,44.25 56.75,44.3 U1.48 | v57.65,42.62 59.5,42.62
  Top 0.305: v61.37,51.75 64.61,48.51 64.61,45.47 64.39,45.25 U1.36
  Top 0.406: 39.95,65.05 39.95,64.2 R12.2 44.85,59.3 v47.3,59.3 | U$3.4 56.85,56.27 R4.1 55.05,59.3 v49.1,59.3
  Top 0.813: U$9.1 64.47,78.53 50.9,78.53 49.2,76.83 49.2,72 44.9,67.7 42.6,67.7 39.95,65.05 C8.+ 36.9,65.15 31.5,65.15 C2.1 31.5,64.95 30.07,66.38 U4.4 v25,64.8 | U$8.1 20.5,37.9 C5.1 20.4,39.8 25,44.4 U4.2
  Bottom 0.254: v56.7,44.25 57.65,43.3 v57.65,42.62 | U$2.P$1 52.14,29.14 56.85,29.14 57.99,28 U$1.P$1
  Bottom 0.305: U$1.P$1 59.5,7.3 JMP10.1 | U$3.4 v61.37,51.75
  Bottom 0.406: v49.1,59.3 v47.3,59.3
  Bottom 0.508: JMP5.1 20.3,55 20.34,55.04 20.34,55.32 24.65,59.62 U4.2
  Bottom 0.61: 24.8,9 JMP8.1 | 42.1,9 24.8,9 | 42.1,9 58.3,9 59.8,7.5 JMP10.1 | JMP9.1 42.1,7.2 42.1,9 | 24.8,9 15,18.8 15,27.45 17.25,29.7 19.2,29.7 20.5,31 U$8.1 | U$15.1 U$14.1 U$13.1 U$9.1
  Bottom 0.813: v25,64.8 U4.2
  other vias: 25,59.62
BOOT  (via drill 0.35)
  Top 0.254: U$2.P$2 R1.2 | R22.2 46.35,26.2 v47.59,26.2
  Bottom 0.254: v47.59,26.2 51.2,26.2 U$2.P$2
BOOT0
  Top 0.254: R1.1 53,35.89 57.04,39.93 57.04,43.07 58.75,44.79 U1.44
BOOT1  (via drill 0.3)
  Top 0.254: U1.20 60.25,36.86 v60.33,36.77
  Bottom 0.254: v60.33,36.77 60.33,36.33 61.5,35.17 R2.2
  other vias: 61.5,31.85
BRN1  (via drill 0.3, 0.35)
  Top 0.254: U3.13 83.06,67.33 82.23,66.5 82.23,61.98 77.6,57.35 v77.39,57.35 | R42.2 75.42,42.43 75.42,51.96 76.97,53.51 v76.97,54.69
  Top 0.305: v85.93,67.53 85.72,67.33 U3.13
  Top 0.406: R27.2 89.15,69.95 86.53,67.33 U3.13
  Bottom 0.254: v76.97,54.69 76.97,56.74 77.39,57.15 v77.39,57.35
  Bottom 0.305: v85.93,67.53 85.73,67.33 85.17,67.33
BRN2  (via drill 0.3)
  Top 0.254: U3.12 83.13,66.67 82.7,66.24 82.7,61.83 76.23,55.37 76.01,55.37 v75.99,55.39 | R16.2 75.01,28.84 75.01,52.46 75.08,52.53 v75.17,52.53
  Top 0.406: R26.2 89.15,67.95 87.88,66.67 U3.12
  Bottom 0.254: v75.17,52.53 75.07,52.63 75.07,54.21 75.99,55.13 v75.99,55.39
BRN3  (via drill 0.3)
  Top 0.254: 88.05,66.03 88.11,66.03 v88.12,66.02 | v84.81,63.54 84.81,63.36 74.58,53.13 74.58,15.18 80.91,8.85 R18.2
  Top 0.406: R25.2 89.12,66.03 88.05,66.03 U3.11
  Bottom 0.254: v88.12,66.02 85.64,63.54 v84.81,63.54
BRN4
  Top 0.254: R20.2 81,51.32 82.49,52.81 82.49,59.3 87.19,64 89.2,64
  Top 0.406: R24.2 89.15,64.05 | 89.2,64 89.15,64.05 | 89.15,64.05 87.82,65.38 U3.10
BURN1
  Top 0.254: U1.16 58.26,35.96 60.03,34.19 65.71,34.19 70.08,38.55 70.08,53.28 80.6,63.81 80.6,65.81 79.08,67.33 U3.4
BURN2
  Top 0.254: U3.5 79.11,66.67 80.18,65.61 80.18,63.97 69.67,53.46 69.67,38.74 65.54,34.6 60.25,34.6 58.75,36.1 U1.17
BURN3
  Top 0.254: U1.18 59.25,36.33 60.56,35.02 65.35,35.02 69.26,38.92 69.26,53.65 79.7,64.09 79.7,65.41 79.09,66.02 U3.6
BURN4
  Top 0.254: U3.7 79.02,65.38 79.26,65.14 79.26,64.24 68.84,53.82 68.84,39.14 65.18,35.48 60.8,35.48 59.75,36.53 U1.19
BUZZER  (via drill 0.3)
  Top 0.254: U1.11 56.4,40.25 v56.45,40.2 | U3.1 79.1,69.28 81.83,66.55 81.83,63.26 71.32,52.75 71.32,37.94 66.31,32.93 58.91,32.93 56.87,34.97 v56.87,35.01
  Bottom 0.254: v56.87,35.01 56.87,39.78 v56.45,40.2
GND  (via drill 0.3, 0.35)
  Top 0.254: L2.C 50.5,23.5 U$2.P$3 55.1,28.1 55.1,28.37 57.75,31.02 62.38,31.02 63.5,29.89 U$1.P$3 | v53.72,40.55 53.84,40.68 53.84,41.05 54.55,41.75 U1.8 | v57.33,45.16 57.25,45.24 U1.47 | v62,44.29 62.46,44.75 U1.35 | v61.59,39.87 61.75,39.7 U1.23
  Top 0.305: C31.2 C33.2 37.46,48.19 J1.2 35.37,52.59 30.55,52.59 28.49,54.64 | C1.2 42.59,29.65 | 42.59,29.65 45.25,29.65 S1.1 49.25,25.65 L2.C L1.C 49.25,15.74 45.85,12.34 45.85,11.09 | L3.C L5.C 39.25,26.32 42.59,29.65 | 72.92,28 72.95,28.03 | U1.47 57.25,48.48 56.95,48.77 v56.94,48.77
  Top 0.406: R7.2 11.65,76.95 v12,76.6 | v47.4,67.5 48.25,66.65 D1.C D11.C 48.25,57.25 U$3.1 50.5,54.55 52.55,52.5 R5.1 | v44.9,69.9 44.1,70.7 44.1,71.5 C7.- | L9.C L8.C L7.C L6.C 93.41,59.66 v92.84,59.66 | U3.8 78.13,64.34 75.95,62.16 v75.95,62.1
  Top 0.508: C6.2 28.49,54.64 31.5,57.65 31.5,60.8 | 31.5,60.8 C2.2 | C8.- 34.31,60.95 | 34.31,60.95 31.65,60.95 31.5,60.8 | 34.31,60.95 34.31,63 v34.33,63.02 | v31.68,69.35 30.7,70.33 U6.1
  Top 0.61: C30.1 45.85,11.09 45.85,4.69 U$12.2 46.54,1.76 46.6,1.7 | 63.6,14.5 64.5,15.4 C4.2 | 63.6,14.5 63.6,4.44 U$7.2 64.04,1.74 64,1.7 | C11.1 61.65,14.5 63.6,14.5 | C7.- 46.4,74 v46.4,77.4 | 19.4,59.62 19.46,59.56 J2.2 19.46,42.56 17.6,40.7 C5.2 9,38 U$8.10 2.5,28 16.7,13.8 26.05,13.8 C32.1 28.35,4.69 U$11.2 31.34,1.7 46.6,1.7 | 46.6,1.7 64,1.7 | 64,1.7 72.9,1.7 | 72.9,1.7 88.8,1.7 98,10.9 U$5.P$1 | C18.- C29.- 72.95,28.03 C14.- C16.- 72.95,1.75 72.9,1.7
  Top 0.813: C3.2 42.45,73.15 C7.- | U6.1 28.18,73.15 C9.2 23.55,73.15 C10.- 16.1,71.6 J9.2 8.55,60.95 C12.- 18.32,59.62 19.4,59.62 U4.1
  Bottom 0.254: v53.72,40.55 55.62,40.55 56.61,41.54 56.61,42.49 55.77,43.34 55.77,44.46 56.47,45.16 v57.33,45.16 58.21,44.29 v62,44.29 62,40.27 v61.59,39.87
  Bottom 0.305: v56.94,48.77 50.71,55 U$3.1
  Bottom 0.406: 14.75,76.35 14.5,76.6 v12,76.6 | v47.4,67.5 45,69.9 v44.9,69.9 | v92.84,59.66 92.55,59.37 92.23,59.37
  Bottom 0.508: v34.33,63.02 34.33,66.7 v31.68,69.35
  Bottom 0.61: v46.4,77.4 v46.4,78.03 | U$9.2 U$13.2 U$14.2 U$15.2 69.54,62.36 69.8,62.1
  Bottom 1.8: U$5.P$1 97.2,12 95.1,14.1 95.1,25.98 | 95.1,25.98 95.1,39.97 | 95.1,39.97 95.1,54.11 | 95.1,54.11 95.1,56.5 92.23,59.37 89.5,62.1 v75.95,62.1 74.83,62.1 | J9.2 7.1,62.5 11.3,66.7 11.3,72.9 14.75,76.35 16.43,78.03 v46.4,78.03 51.06,78.03 67,62.1 69.8,62.1 74.91,62.1 | U$4.P$1 95.12,26 95.1,25.98 | U$21.P$1 95.13,40 95.1,39.97 | U$6.P$1 95.21,54 95.1,54.11
  other vias: 59.85,44.45 50.75,34.3 65.32,37.2 65.74,43.19 62.2,49.31 64.66,49.81 76.69,38.29 79.37,53.44 19.08,24.99 19.31,28.11
  pour Top (isolate 0.305): -1,77 arc-90 3,81 97,81 arc-90 101,77 101,3 arc-90 97,-1 3,-1 arc-90 -1,3
  pour Bottom (isolate 0.305): 101,77 arc90 97,81 3,81 arc90 -1,77 -1,3 arc90 3,-1 97,-1 arc90 101,3
N$1  (via drill 3.1)
  other vias: 97,77
N$2
  Top 0.406: R7.1 13.95,76.9 Q6.G
N$3  (via drill 3.1)
  other vias: 97,3
N$4  (via drill 3.1)
  other vias: 3,3
N$5
  Top 0.254: R2.1 U$1.P$2
N$6  (via drill 3.1)
  other vias: 3,77
N$7
  Top 0.406: D1.A R6.1
N$8
  Top 0.406: R12.1 D11.A
N$9
  Top 0.254: JMP6.2 21.89,25 22.56,25.68 22.56,28.41 22,28.97 20.79,28.97 18.5,31.26 U$8.2
N$10
  Top 0.254: JMP7.2 16.79,25 15.68,26.11 15.68,30.68 U$8.3
N$11
  Top 0.61: C30.2 44.15,4.15 U$12.1
  Bottom 0.61: JMP9.2 U$12.1
N$12
  Top 0.254: L3.A R14.1
N$13
  Top 1.016: U$4.P$2 91.9,28.54 | 91.9,28.54 86.04,28.54 Q3.3 | D2.A 91.9,28.93 91.9,28.54
N$14
  Top 0.406: R16.1 81.05,21.2 Q3.1 84.95,21.2 R15.1
N$15
  Top 1.016: Q4.3 92,14.5 | 92,14.5 97.96,14.5 U$5.P$2 | D6.A 92,14.5
N$16
  Top 0.406: R17.1 84.95,7.2 Q4.1 81.05,7.2 R18.1
N$17
  Top 1.016: Q5.3 86.53,57.02 D7.A 97.51,57.02 U$6.P$2
N$18
  Top 0.406: R19.1 84.95,49.2 Q5.1 81.05,49.2 R20.1
N$19
  Top 0.254: U1.5 48.65,43.25 46.5,45.4 Q2.2 46.06,45.85 C33.1
N$20
  Top 0.254: U1.6 48.66,42.75 Q2.1 46.06,40.15 C31.1
N$21
  Top 0.254: L1.A R21.1
N$22
  Top 0.254: L2.A R22.1
N$23
  Top 0.254: L5.A R23.1
N$24
  Top 0.406: L6.A R24.1
N$25
  Top 0.406: L7.A R25.1
N$26
  Top 0.406: L8.A R26.1
N$27
  Top 0.406: L9.A R27.1
N$28
  Top 0.61: C11.2 U$7.1
  Bottom 0.61: JMP10.2 U$7.1
N$29
  Bottom 0.254: JMP5.2 J2.1 23.86,48.64 38.14,48.64 J1.1
N$30  (via drill 0.35)
  Top 0.254: J1.3 34.92,50.06 v32.59,47.73
  Bottom 0.254: J2.3 19.69,47.73 v32.59,47.73 | J1.3 34.92,54.42
  Bottom 0.406: 34.92,54.42 JMP1.2
N$31  (via drill 0.35)
  Top 0.254: J1.4 32.38,50 v29.34,46.97
  Bottom 0.254: JMP2.2 14.5,50.62 J2.4 14.38,50.45 17.83,47 29.31,47 v29.34,46.97
N$49
  Top 0.61: U$11.1 26.5,11.35 C32.2
  Bottom 0.61: JMP8.2 U$11.1
N$59
  Top 0.152: D5.A 11.58,74.07 Q6.D
  Top 2: J9.1 7,69.55 Q6.D
N$71
  Top 0.406: U3.15 84.91,68.62 85.42,69.14 85.42,73.04 U$20.P$2
N$72
  Top 0.406: U3.14 85.23,67.97 88,70.75 U$22.P$2
N$76
  Top 0.152: U$19.- 59.44,69.49 59.25,69.49
  Top 0.406: D3.A 57.15,66.25 59.25,68.35 59.25,69.49 LS1.- 61.01,74.77 67.72,74.77 68.27,75.31 68.27,76.78 69.46,77.98 74.38,77.98 83.08,69.28 U3.16
N$77
  Top 0.152: 52.7,69.34 52.58,69.34 U$19.+
  Top 0.406: U$19.+ 52.7,69.7 52.7,72.95 LS1.+ | R40.1 54.85,63.8 D3.C 52.7,67.65 52.7,69.34 52.7,69.5
N$78
  Top 1.016: Q1.3 91.47,42.5 91.51,42.54 | 91.51,42.54 D4.A | U$21.P$2 91.51,42.54
N$79
  Top 0.406: R41.1 84.95,35.2 Q1.1 81.05,35.2 R42.1
PA13
  Top 0.254: 55.58,54.73 U$3.3 55.85,54.73 R5.2 63.61,52.5 66.47,49.65 66.47,45.58 65.13,44.25 U1.34
PA14
  Top 0.254: R4.2 55.15,57.11 U$3.2 53.29,55 55.02,53.27 55.02,51.88 56.23,50.67 59.58,50.67 62.25,48 U1.37
PB12
  Top 0.254: U1.25 66.23,39.75 68.17,41.69 68.17,54.23 75.14,61.2 75.14,72.94 U$9.3
PB13
  Top 0.254: U$13.3 74.74,70.84 74.74,61.41 67.72,54.4 67.72,41.82 66.14,40.25 U1.26
PB14
  Top 0.254: U1.27 66.03,40.75 67.29,42.01 67.29,54.66 74.23,61.6 74.23,70.26 73.49,71 U$14.3
PB15
  Top 0.254: U1.28 65.85,41.25 66.88,42.27 66.88,55 73.71,61.83 73.71,66.87 U$15.3
PC13  (via drill 0.3)
  Top 0.254: R21.2 43.53,20.12 v43.53,21.11 | v53.81,44.9 53.96,44.75 U1.2
  Bottom 0.254: v53.81,44.9 53.26,44.35 53.26,43.47 43.53,33.74 v43.53,21.11
PC14  (via drill 0.3)
  Top 0.254: v51.69,44.05 52.18,44.53 52.91,44.53 53.19,44.25 U1.3 | v32.9,21.48 32.9,20.75 R14.2
  Bottom 0.254: v51.69,44.05 51.65,44.01 51.65,43.99 32.9,25.24 v32.9,21.48
PC15  (via drill 0.3)
  Top 0.254: R23.2 v33.65,24.34 v33.65,24.35 | U1.4 52.72,43.75 v52.6,43.87
  Bottom 0.254: v33.65,24.35 33.65,24.99 52.52,43.87 v52.6,43.87
RST  (via drill 0.3)
  Top 0.254: S1.2 46.5,33.19 v46.48,33.2 | v46.97,34.78 54.44,42.25 U1.7
  Top 0.305: R3.1 C1.1 45.25,31.35 S1.2
  Bottom 0.254: v46.48,33.2 46.48,34.3 v46.97,34.78
RX1  (via drill 0.3)
  Top 0.254: U$12.3 57.55,12.47 v57.55,29.6 | v60.25,41.79 61.21,42.75 U1.31
  Bottom 0.254: v57.55,29.6 57.55,39.09 v60.25,41.79
RX2  (via drill 0.3)
  Top 0.254: U$11.3 31.58,11.64 21.03,22.19 v21.03,23.28 21.03,23.3 JMP6.3 JMP7.1 | U1.13 56.27,38.32 v56.26,38.31 | v54.22,39.04 52.64,39.04 47.39,33.79 31.85,33.79 25.08,27.02 25.08,26.89 v25.06,26.89
  Bottom 0.254: v56.26,38.31 55.53,39.04 v54.22,39.04 | v25.06,26.89 21.46,23.28 v21.03,23.28
SCL1  (via drill 0.3)
  Top 0.254: U1.42 59.75,48.77 58.36,50.16 52.81,50.16 48.5,54.47 33.28,54.47 v33.3,54.49
  Bottom 0.152: JMP1.1 33.38,54.56 v33.3,54.49
SCL2/TX3  (via drill 0.3)
  Top 0.254: U1.21 60.75,37.22 61.22,36.75 61.22,36.39 v61.54,36.07
  Bottom 0.254: U$7.3 68.07,5.49 68.07,29.54 v61.54,36.07 67.93,42.45 67.93,52.51 63.31,57.13 39.33,57.13 JMP1.3
SDA1  (via drill 0.3)
  Top 0.254: U1.43 59.25,48.69 58.28,49.67 41.65,49.67 v40.14,48.16
  Bottom 0.254: v40.14,48.16 38.03,46.05 16.75,46.05 13.06,49.74 13.06,54.24 JMP2.1
SDA2/RX3  (via drill 0.3)
  Top 0.254: v23.65,56.52 v20.37,56.52 v20.36,56.53 | v62.41,36.07 62.38,36.07 61.74,36.7 61.74,36.9 61.25,37.39 U1.22
  Bottom 0.254: v20.36,56.53 18.33,54.5 JMP2.3 | U$7.4 69.12,29.36 v62.41,36.07 68.33,41.99 68.33,52.74 63.53,57.53 24.66,57.53 v23.65,56.52
TX1  (via drill 0.3)
  Top 0.254: U$12.4 58.13,10.52 v58.13,30.33 | v61.26,41.98 61.54,42.25 U1.30
  Bottom 0.254: v58.13,30.33 58.13,38.85 v61.26,41.98
TX2  (via drill 0.3)
  Top 0.254: U$11.4 34.12,10.36 23.99,20.5 v23.99,26.68 v23.99,26.69 31.49,34.2 47.21,34.2 52.76,39.75 U1.12 | 21.53,26.7 v21.21,26.7 JMP6.1 JMP7.3
  Bottom 0.254: v23.99,26.68 21.23,26.68 v21.21,26.7
UL2
  Top 0.254: U1.14 57.25,35.54 59.42,33.37 66.15,33.37 70.91,38.13 70.91,52.92 81.42,63.43 81.42,66.28 79.07,68.62 U3.2
UL3
  Top 0.254: U3.3 78.15,67.99 79.05,67.99 81.01,66.03 81.01,63.63 70.5,53.11 70.5,38.33 65.94,33.77 59.73,33.77 57.75,35.75 U1.15
VCC  (via drill 0.35)
  Top 0.152: v18.27,63.61 18.29,63.55 18.29,63.6
  Top 0.406: R6.2 42.05,65.1 v42,65.1 | v37.5,69.7 36.6,70.6
  Top 0.508: U4.3 27.3,56.52 26.65,55.88 C6.1 v25.94,54.5
  Top 0.61: C4.1 66,10 v65.1,9.1
  Top 0.813: U6.4 38,77.38 | 38,77.38 43.03,77.38 C7.+ | 38,77.38 C3.1 37.35,74.85 36.6,74.1 36.6,70.6 36.6,69.4 35.4,68.2 32.9,68.2 | U6.2 32.9,70.53 32.9,68.2 | 32.9,68.2 19.35,68.2 17,65.85 C12.+ 17,64.25 17.65,63.6 18.29,63.6 v19.16,63.6 23.8,63.6 27.3,60.1 U4.3
  Bottom 0.406: v42,65.1 37.5,69.6 v37.5,69.7
  Bottom 0.508: 63.5,7.3 63.5,5.64 62.78,4.92 62.78,3.08 62.5,2.8 | JMP9.3 45.7,6.04 45.28,5.62 45.28,2.38 45.2,2.3 | JMP5.3 v25.94,54.5 | JMP8.3 28.2,4.94 27.78,4.52 27.78,2.71 27.24,2.17 24.15,2.17 22.55,3.77 22.55,9.31 1.2,30.66 1.2,51.18 13.62,63.6 v19.16,63.6
  Bottom 0.61: v65.1,9.1 65.1,8.9 63.5,7.3 JMP10.3 | JMP8.3 38.69,7 43.39,2.3 45.2,2.3 62,2.3 62.5,2.8
VIN  (via drill 0.35)
  Top 0.152: v18.53,75.4 18.59,75.44 18.59,75.4 | v19.43,75.4 19.51,75.44 19.51,75.4 | v92,10 92.05,10.06 92,10.06 | v92,11 92.05,10.97 D6.C | v92,22.4 92.05,22.4 v92,22.4 | v92,23.3 92.05,23.32 92,23.32 | v92,37.1 92.05,37.03 92,37.03 | v92,38 92.05,37.95 92,37.95 | v92,51.5 92.05,51.51 92,51.51 | v92,52.4 92.05,52.43 D7.C
  Top 0.406: R40.2 58.7,63.5 v58.8,63.4 | v81.7,59.39 81.73,59.39 85.71,63.38 85.71,64.46 85.82,64.57 85.66,64.72 U3.9 83.88,64.73 85.65,64.73 v85.8,64.59 | U$22.P$1 U$20.P$1
  Top 0.813: D5.C 15.43,74.1 14.35,74.1 Q6.S 14.35,73.3 14.9,73.3 | C10.+ 22,74.85 C9.1 32.45,74.85 35.3,72 U6.3 | C16.+ 77.05,8.7 80.25,5.5 85.85,5.5 86.85,6.5 R17.2 | R15.2 86.85,20.38 86.32,19.84 78.81,19.84 77.65,21 C14.+ | R41.2 86.85,34.38 86.32,33.84 78.81,33.84 77.65,35 C29.+ | R19.2 86.85,48.38 86.32,47.84 78.81,47.84 77.65,49 C18.+
  Top 1.016: R17.2 88.08,7 Q4.2 90.1,7.2 v92,9.1 | v92,21.5 91.7,21.2 Q3.2 88.08,21 R15.2 | R41.2 88.08,35 Q1.2 90.9,35.2 91.9,36.2 v92,36.2 | R19.2 88.08,49 Q5.2 90.5,49.2 91.9,50.6 v92,50.6
  Top 2: D5.C 15.72,73.8 16.03,73.8 v17.62,75.4 v18.53,75.4 18.59,75.4 v19.43,75.4 19.51,75.4 21.2,75.4 22,76.2 C10.+ | D7.C v92,52.4 92,51.51 v92,51.5 v92,50.6 | D4.C v92,38 92,37.95 v92,37.1 92,37.03 v92,36.2 | D2.C 92,23.32 v92,23.3 v92,22.4 v92,21.5 | D6.C 92,10.06 v92,10 v92,9.1
  Bottom 0.152: 20.42,75.4 20.42,75.44 v20.32,75.4
  Bottom 0.406: U$22.P$1 86.45,75.45 86.45,68.9 87.42,67.94 87.42,66.21 v85.8,64.59
  Bottom 2: v17.62,75.4 v20.32,75.4 20.42,75.4 46.8,75.4 v58.8,63.4 62.81,59.39 v81.7,59.39 88.01,59.39 92,55.4 v92,50.6 v92,36.2 v92,21.5 v92,9.1

### Text on the board
tPlace: + | B12 | B13 | - | A4 | A5 | B14 | 1 | + | B15 | 2 | A1 | 3V3 | GND | S | 3 | 5V | 4 | - | 3V3 | Nimbus-21 | + | Brn4 | - | G | 3 | B1 | + | Brn1 | - | A6 | 0 | 1 | 1 | 0 | 1 | 0 | + | TX | RST | Brn2 | C15 | Boot | - | A7 | RX | C14 | C13 | + | Brn3 | - | B0 | V | GND | RX2 | TX2 | V | GND | RX1 | TX2 | V | GND | SCL2 | SDA2 | TX3 | RX3
bPlace: i1 | i2 | 3 | 5 | i1 | i2 | MARMARA | DYNAMICS | Nimbus-21 | 3 | 5 | 3 | 5 | 3 | 5